# Altium project Dual-Node-Performance-Tracker.PrjPcb
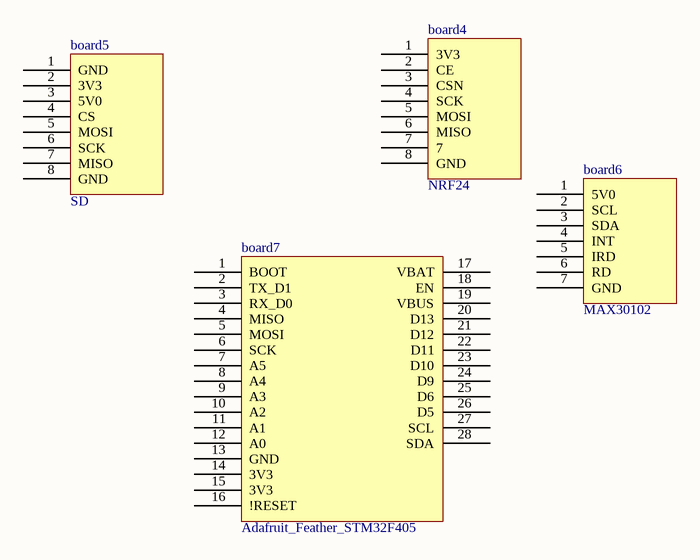
[diagram p0: wrist_sch.SchDoc]
2 sheets, 6 parts. Net scope: global (net labels, ports and power ports of the same name join across sheets).
Board files: ankle_pcb.PcbDoc, wrist_pcb.PcbDoc
Sheets:
  wrist_sch.SchDoc
  ankle_sch.SchDoc

## Sheet wrist_sch.SchDoc
size A; SheetNumber: 1; SheetTotal: 2

### Parts
board4  NRF24  [nrf24]
board5  SD  [sd]
board6  MAX30102  [max30102]
board7  Adafruit_Feather_STM32F405  [Adafruit_Feather_STM32F405]

### Nets

Not connected (* = marked no-connect by the designer): board4 1(3V3) 2(CE) 3(CSN) 4(SCK) 5(MOSI) 6(MISO) 7 8(GND); board5 1(GND) 2(3V3) 3(5V0) 4(CS) 5(MOSI) 6(SCK) 7(MISO) 8(GND); board6 1(5V0) 2(SCL) 3(SDA) 4(INT) 5(IRD) 6(RD) 7(GND); board7 1(BOOT) 2(TX_D1) 3(RX_D0) 4(MISO) 5(MOSI) 6(SCK) 7(A5) 8(A4) 9(A3) 10(A2) 11(A1) 12(A0) 13(GND) 14(3V3) 15(3V3) 16(!RESET) 17(VBAT) 18(EN) 19(VBUS) 20(D13) 21(D12) 22(D11) 23(D10) 24(D9) 25(D6) 26(D5) 27(SCL) 28(SDA)

## Sheet ankle_sch.SchDoc
size A; SheetNumber: 2; SheetTotal: 2
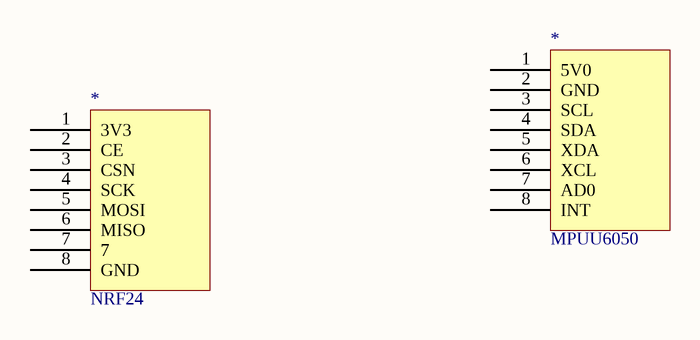
[diagram p1: ankle_sch.SchDoc]

### Parts
(Parts that share a designator on the sheet are numbered #1, #2 ... from top to bottom, then left to right.)
*#1  MPUU6050  [mpu6050]
*#2  NRF24  [nrf24]

### Nets

Not connected (* = marked no-connect by the designer): *#1 1(5V0) 2(GND) 3(SCL) 4(SDA) 5(XDA) 6(XCL) 7(AD0) 8(INT); *#2 1(3V3) 2(CE) 3(CSN) 4(SCK) 5(MOSI) 6(MISO) 7 8(GND)